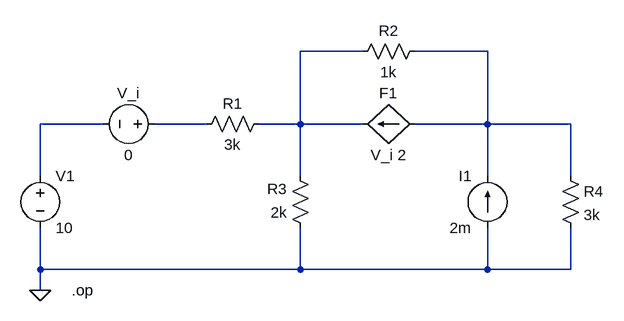
[diagram p0: schematic CH03-KP1-13.asc]
CH03-KP1-13.asc, the LTspice schematic file:
Version 4
SHEET 1 880 680
WIRE 336 112 240 112
WIRE 528 112 416 112
WIRE -64 224 -160 224
WIRE 96 224 16 224
WIRE 240 224 240 112
WIRE 240 224 176 224
WIRE 336 224 240 224
WIRE 528 224 528 112
WIRE 528 224 416 224
WIRE 656 224 528 224
WIRE -160 304 -160 224
WIRE 240 304 240 224
WIRE 528 304 528 224
WIRE 656 304 656 224
WIRE -160 448 -160 384
WIRE 240 448 240 384
WIRE 240 448 -160 448
WIRE 528 448 528 384
WIRE 528 448 240 448
WIRE 656 448 656 384
WIRE 656 448 528 448
WIRE -160 480 -160 448
FLAG -160 480 0
SYMBOL voltage -160 288 R0
SYMATTR InstName V1
SYMATTR Value 10
SYMBOL voltage 32 224 R90
WINDOW 0 -32 56 VBottom 2
WINDOW 3 32 56 VTop 2
SYMATTR InstName V_i
SYMATTR Value 0
SYMBOL res 192 208 R90
WINDOW 0 0 56 VBottom 2
WINDOW 3 32 56 VTop 2
SYMATTR InstName R1
SYMATTR Value 3k
SYMBOL res 432 96 R90
WINDOW 0 0 56 VBottom 2
WINDOW 3 32 56 VTop 2
SYMATTR InstName R2
SYMATTR Value 1k
SYMBOL res 256 400 R180
WINDOW 0 36 76 Left 2
WINDOW 3 36 40 Left 2
SYMATTR InstName R3
SYMATTR Value 2k
SYMBOL res 640 288 R0
SYMATTR InstName R4
SYMATTR Value 3k
SYMBOL current 528 384 R180
WINDOW 0 24 80 Left 2
WINDOW 3 24 0 Left 2
SYMATTR InstName I1
SYMATTR Value 2m
SYMBOL f 416 224 R90
WINDOW 0 -32 40 VBottom 2
WINDOW 3 32 40 VTop 2
SYMATTR InstName F1
SYMATTR Value V_i 2
TEXT -112 480 Left 2 !.op

The netlist it stands for:
* CH03-KP1-13.asc
V1 N003 0 10
V_i N004 N003 0
R1 N001 N004 3k
R2 N002 N001 1k
R3 0 N001 2k
R4 N002 0 3k
I1 0 N002 2m
F1 N002 N001 V_i 2
.op
.backanno
.end